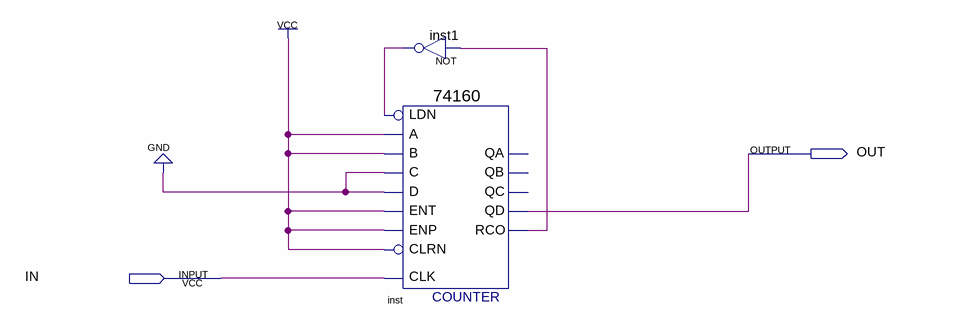
[diagram p0: schematic sheet]
// Quartus schematic 7DIV.bdf as structural Verilog: 2 symbols, 2 pins
module \7DIV  (
  input  IN,
  output OUT
);

  wire inst1_out, inst_rco;

  not inst1 (inst1_out, inst_rco);
  \74160  inst (
    .CLK(IN), .ENT(1'b1), .A(1'b1), .B(1'b1), .C(1'b0), .D(1'b0), .LDN(inst1_out), .ENP(1'b1), .CLRN(1'b1),
    .QD(OUT), .RCO(inst_rco));  // open: QA, QB, QC
endmodule
